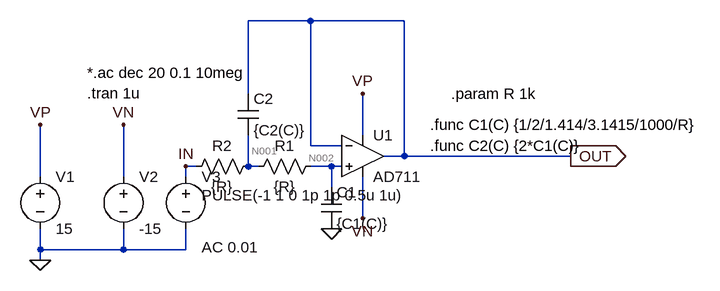
[diagram p0: schematic A2 31step.asc]
A2 31step.asc, the LTspice schematic file:
Version 4
SHEET 1 880 680
WIRE 80 -32 -16 -32
WIRE 224 -32 80 -32
WIRE -16 80 -16 -32
WIRE 160 144 160 80
WIRE 80 160 80 -32
WIRE 128 160 80 160
WIRE 224 176 224 -32
WIRE 224 176 192 176
WIRE 480 176 224 176
WIRE -96 192 -112 192
WIRE -16 192 -16 144
WIRE 0 192 -16 192
WIRE 112 192 80 192
WIRE 128 192 112 192
WIRE -336 208 -336 128
WIRE -208 208 -208 128
WIRE -112 208 -112 192
WIRE 112 224 112 192
WIRE 160 272 160 208
WIRE -336 320 -336 288
WIRE -208 320 -208 288
WIRE -208 320 -336 320
WIRE -112 320 -112 288
WIRE -112 320 -208 320
WIRE -336 336 -336 320
FLAG 160 80 VP
FLAG 160 272 VN
FLAG -336 336 0
FLAG -336 128 VP
FLAG -208 128 VN
FLAG 480 176 OUT
IOPIN 480 176 Out
FLAG 112 288 0
FLAG -112 192 IN
SYMBOL OpAmps\\AD711 160 112 R0
SYMATTR InstName U1
SYMBOL voltage -336 192 R0
SYMATTR InstName V1
SYMATTR Value 15
SYMBOL voltage -208 192 R0
SYMATTR InstName V2
SYMATTR Value -15
SYMBOL voltage -112 192 R0
WINDOW 123 24 124 Left 2
WINDOW 39 0 0 Left 0
WINDOW 3 24 44 Left 2
SYMATTR Value2 AC 0.01
SYMATTR Value PULSE(-1 1 0 1p 1p 0.5u 1u)
SYMATTR InstName V3
SYMBOL res 96 176 R90
WINDOW 0 0 56 VBottom 2
WINDOW 3 32 56 VTop 2
SYMATTR InstName R1
SYMATTR Value {R}
SYMBOL cap 96 224 R0
SYMATTR InstName C1
SYMATTR Value {C1(C)}
SYMBOL res 0 176 R90
WINDOW 0 0 56 VBottom 2
WINDOW 3 32 56 VTop 2
SYMATTR InstName R2
SYMATTR Value {R}
SYMBOL cap -32 80 R0
SYMATTR InstName C2
SYMATTR Value {C2(C)}
TEXT -264 48 Left 2 !*.ac dec 20 0.1 10meg\n.tran 1u
TEXT 296 80 Left 2 !.param R 1k
TEXT 264 160 Left 2 !.func C2(C) {2*C1(C)}
TEXT 264 128 Left 2 !.func C1(C) {1/2/1.414/3.1415/1000/R}

The netlist it stands for:
* A2 31step.asc
XU1 N002 OUT VP VN OUT AD712  ; AD711, pins In+ In- V+ V- OUT
V1 VP 0 15
V2 VN 0 -15
V3 IN 0 PULSE(-1 1 0 1p 1p 0.5u 1u) AC 0.01
R1 N002 N001 {R}
C1 N002 0 {C1(C)}
R2 N001 IN {R}
C2 OUT N001 {C2(C)}
*.ac dec 20 0.1 10meg
.tran 1u
.param R 1k
.func C2(C) {2*C1(C)}
.func C1(C) {1/2/1.414/3.1415/1000/R}
.lib ADI1.lib
.backanno
.end

* Results of the author's LTspice run, read from the files saved beside the schematic
* Operating Point, zero values left out:
*   V(out) = -1 V
*   V(n002) = -1 V
*   V(vp) = 15 V
*   V(vn) = -15 V
*   V(in) = -1 V
*   V(n001) = -1 V
*   I(R2) = -22.33 pA
*   I(R1) = -22.33 pA
*   I(V3) = -22.33 pA
*   I(V2) = 4.899 mA
*   I(V1) = -4.899 mA
*   Ix(u1:1) = 22.33 pA
*   Ix(u1:2) = 22.33 pA
*   Ix(u1:3) = 4.899 mA
*   Ix(u1:4) = -4.899 mA
*   Ix(u1:5) = -20.33 pA
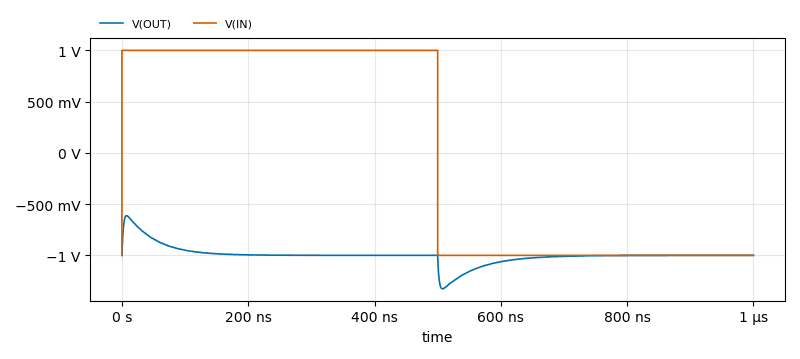
[diagram p1: Transient Analysis of A2 31step.asc, plotted from the saved traces]
* Transient Analysis, 1 run:
*   V(OUT): min -1.326 V, max -613.1 mV, average -1 V, rms 1.004 V, last -1 V
*   V(IN): min -1 V, max 1 V, average 2 µV, rms 1 V, last -1 V